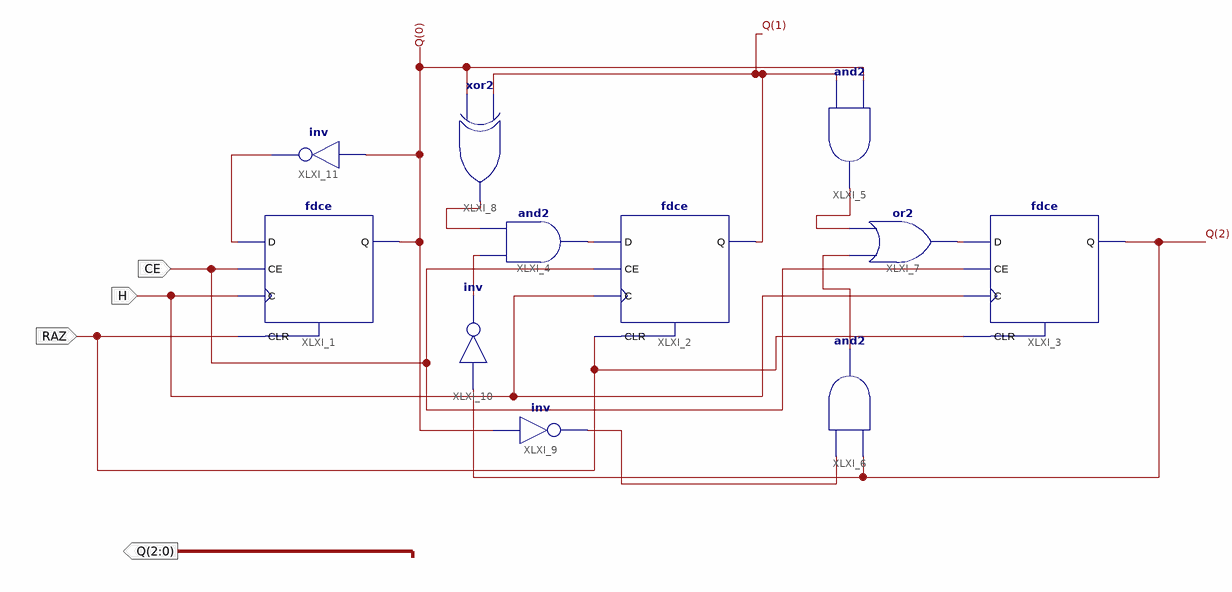
[diagram p0: schematic sheet 1]
// Xilinx ISE schematic circuit1.sch (artix7) as structural Verilog: 11 symbols, 4 ports
module circuit1 (
  input  CE,
  input  H,
  input  RAZ,
  output [2:0] Q
);

  wire XLXN_4, XLXN_5, XLXN_6, XLXN_8, XLXN_9, XLXN_11, XLXN_12, XLXN_13;

  fdce XLXI_1 (.C(H), .CE(CE), .CLR(RAZ), .D(XLXN_12), .Q(Q[0]));
  fdce XLXI_2 (.C(H), .CE(CE), .CLR(RAZ), .D(XLXN_13), .Q(Q[1]));
  fdce XLXI_3 (.C(H), .CE(CE), .CLR(RAZ), .D(XLXN_5), .Q(Q[2]));
  and XLXI_4 (XLXN_13, XLXN_9, XLXN_8);
  and XLXI_5 (XLXN_4, Q[1], Q[0]);
  and XLXI_6 (XLXN_6, Q[2], XLXN_11);
  or XLXI_7 (XLXN_5, XLXN_6, XLXN_4);
  xor XLXI_8 (XLXN_8, Q[0], Q[1]);
  not XLXI_9 (XLXN_11, Q[0]);
  not XLXI_10 (XLXN_9, Q[2]);
  not XLXI_11 (XLXN_12, Q[0]);
endmodule
